# EAGLE design Bridge rectifier (EAGLE 7.2.0)
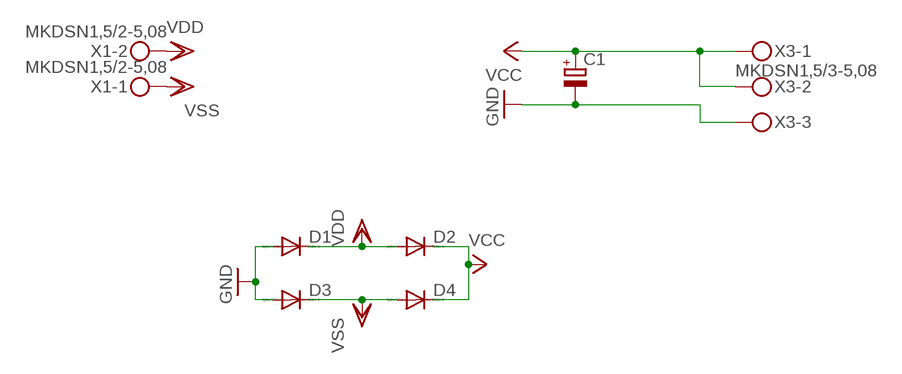
[diagram p0: schematic, sheet 1]

## Parts
C1  CPOL-EUE2.5-7  [E2,5-7]
D1  DIODE-DO-214AC  [DO-214AC]
D2  DIODE-DO-214AC  [DO-214AC]
D3  DIODE-DO-214AC  [DO-214AC]
D4  DIODE-DO-214AC  [DO-214AC]
X1  MKDSN1,5/2-5,08  [MKDSN1,5/2-5,08]
X3  MKDSN1,5/3-5,08  [MKDSN1,5/3-5,08]

## Nets
GND: C1.- D1.A D3.A X3.3
VCC: C1.+ D2.C D4.C X3.1 X3.2
VDD: D1.C D2.A X1.2
VSS: D3.C D4.A X1.1

## Library data of the parts
C1 = rcl:CPOL-EU: POLARIZED CAPACITOR, European symbol
D1-D4 = diode:DIODE-: DIODE
X1 = con-phoenix-508:MKDSN1,5/2-5,08: MKDSN 1,5/ 2-5,08 Printklemme Nennstrom: 13,5 A Nennspannung: 250 V Rastermaß: 5,08 mm Polzahl: 2 Anschlussart: Schraubanschluss Montage: Löten Anschlussrichtung Leiter/Platine: 0 ° Artikelnummer: 1729128 Source: http://eshop.phoenixcontact.com .. 1729128.pdf
X3 = con-phoenix-508:MKDSN1,5/3-5,08: MKDSN 1,5/ 3-5,08 Printklemme Nennstrom: 13,5 A Nennspannung: 250 V Rastermaß: 5,08 mm Polzahl: 3 Anschlussart: Schraubanschluss Montage: Löten Anschlussrichtung Leiter/Platine: 0 ° Artikelnummer: 1729131 Source: http://eshop.phoenixcontact.com .. 1729131.pdf

## Board
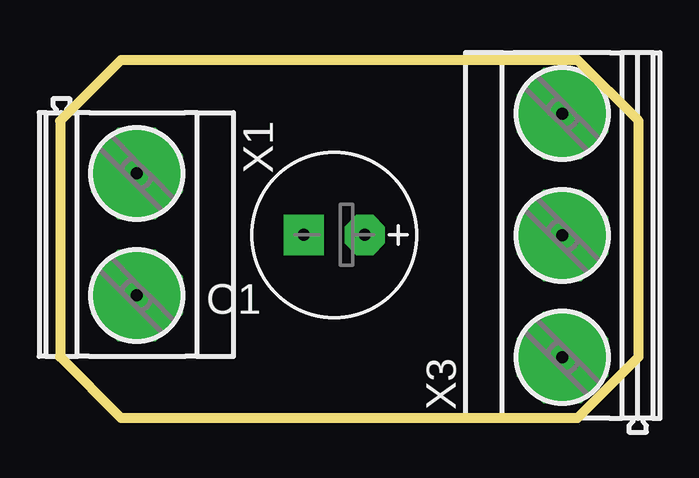
[diagram p1: board, top side]
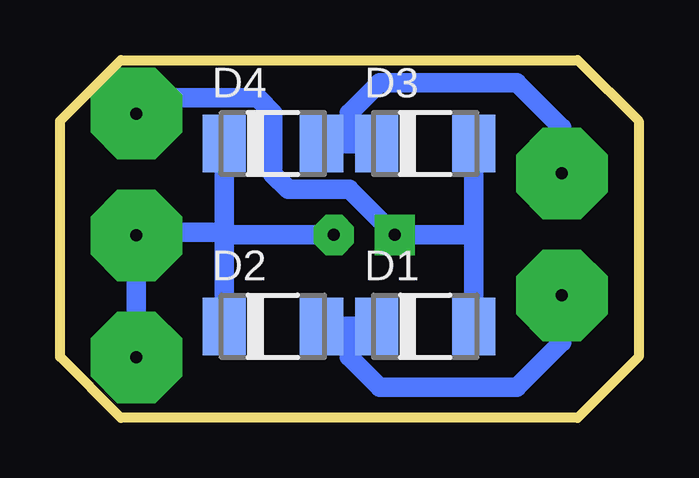
[diagram p2: board, bottom side, seen from below]

Size 24.11 x 14.91 mm. Coordinates in mm from the lower left corner, seen from the top.
Outline: 2.54,0 21.57,0 24.11,2.54 24.11,12.37 21.57,14.91 2.54,14.91 0,12.37 0,2.54 2.54,0
Copper layers (1*16): Top 0.035mm / dielectric 1.5mm / Bottom 0.035mm
Design rules "default": minimum track width 10mil, minimum drill 24mil, track to track 8mil, track to pad 8mil, pad to pad 8mil, via to via 8mil, smd to smd 8mil, copper to edge 40mil, drill to drill 8mil, minimum pad ring 10mil, minimum via ring 8mil, stop-mask expansion 4mil, vias tented up to drill 0mil, thermal gap 10mil

### Footprints (pad centres in the part's own frame; a part is rotated, then mirrored left to right if it is on the bottom)
E2,5-7 = drill 0.5 pad 1.676 octagon: + -1.27,0 | drill 0.5 pad 1.676 square: - 1.27,0
DO-214AC = smd 1.8 x 2.4: A 2.025,0; C -2.025,0
MKDSN1,5/2-5,08 = drill 0.5 pad 3.81 octagon: 1 -2.561,0.025; 2 2.519,0.025
MKDSN1,5/3-5,08 = drill 0.5 pad 3.81 octagon: 1 -7.641,0.025; 2 -2.561,0.025; 3 2.519,0.025

### Placement (x,y rotation side)
C1  11.43,7.62 180 top
D1  8.89,3.81 0 bottom
D2  15.24,3.81 0 bottom
D3  8.89,11.43 0 bottom
D4  15.24,11.43 0 bottom
X1  3.17,7.62 270 top
X3  20.96,10.16 90 top

### Tracks (layer width: path | path; a pad name or v marks a point on that pad's centre or on a via)
GND
  Bottom 0.813: D3.A 6.86,7.62 | 6.86,7.62 D1.A | 6.86,7.62 C1.- 12.07,9.53 14.61,9.53 15.24,10.16 15.24,12.7 15.88,13.34 20.91,13.34 X3.3
VCC
  Bottom 0.813: X3.1 X3.2 20.15,7.74 17.27,7.74 | C1.+ 17.14,7.62 17.27,7.74 | D4.C 17.27,7.74 | D2.C 17.27,7.74
VDD
  Bottom 0.813: X1.2 3.2,3.15 5.08,1.27 10.8,1.27 12.07,2.54 12.07,3.81 | 12.07,3.81 D1.C | D2.A 12.07,3.81
VSS
  Bottom 0.813: X1.1 3.2,12.09 5.08,13.97 10.8,13.97 12.07,12.7 12.07,11.43 | 12.07,11.43 D3.C | D4.A 12.07,11.43